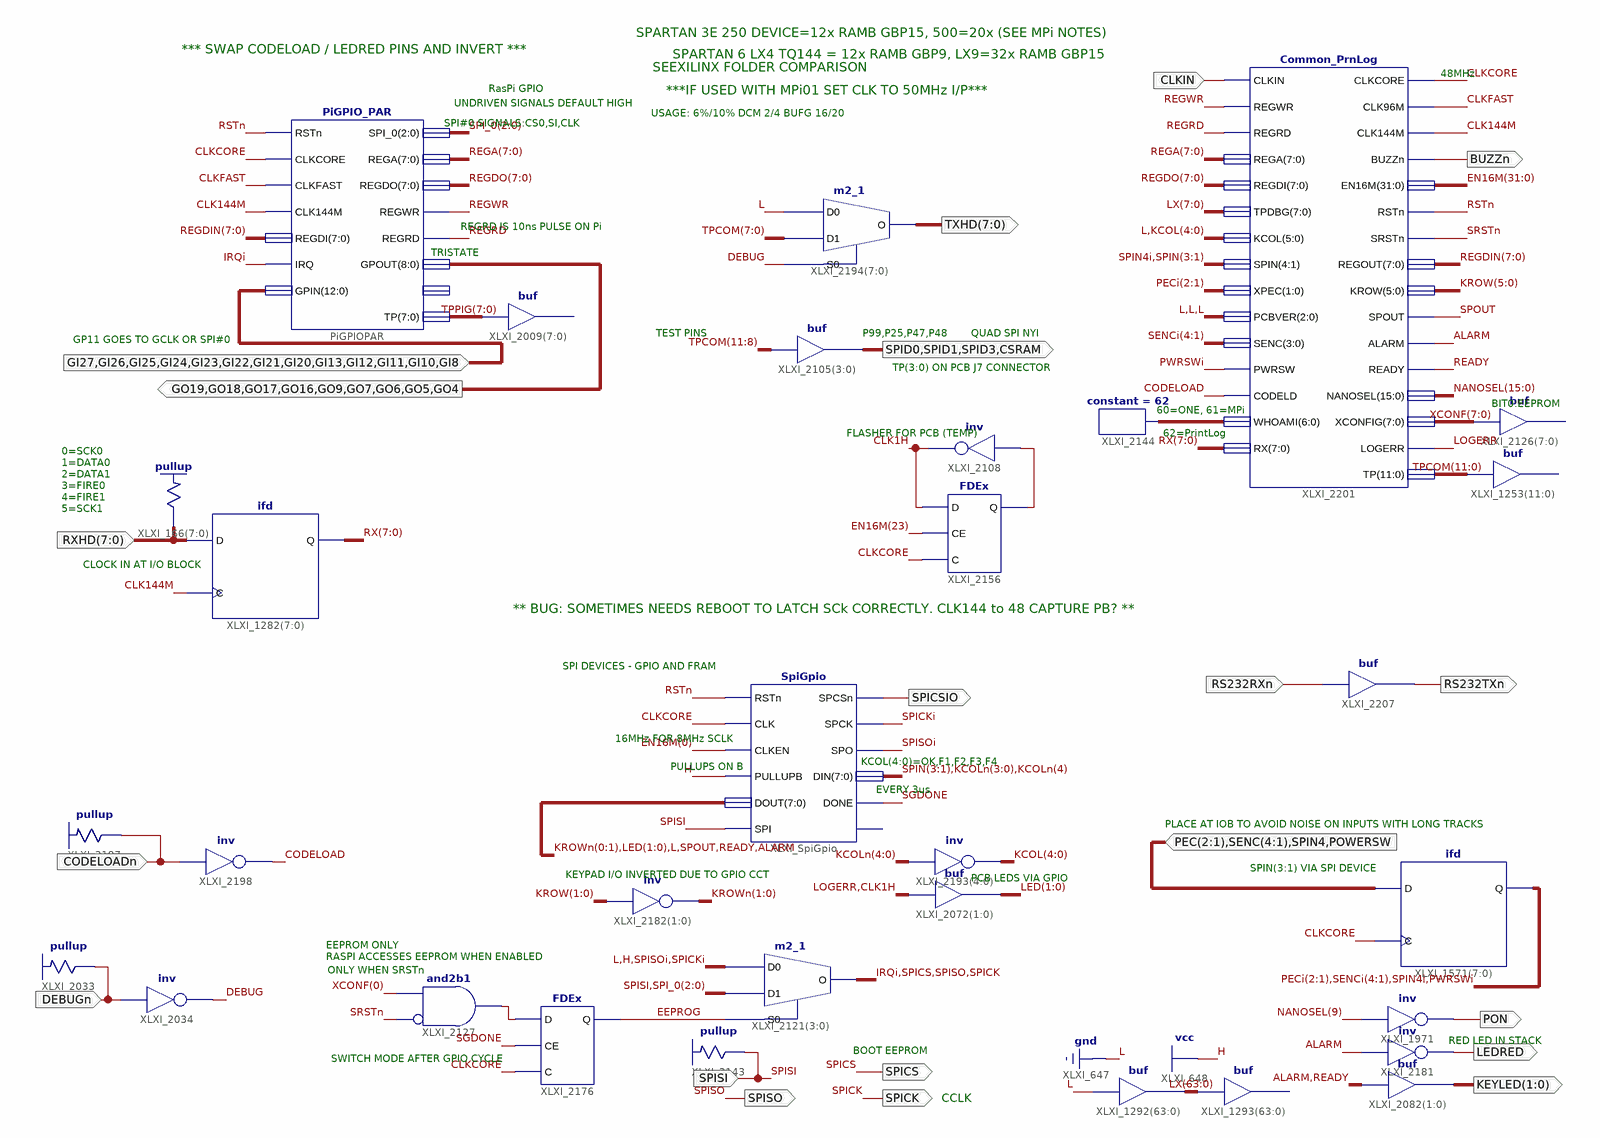
[diagram p0: schematic sheet 1]
// Xilinx ISE schematic PrintLog_MPi02.sch (spartan6) as structural Verilog: 31 symbols, 20 ports
module PrintLog_MPi02 (
  input  DEBUGn,
  input  [7:0] RXHD,
  input  SPISI,
  input  [2:1] PEC,
  input  [4:1] SENC,
  input  SPIN4,
  input  POWERSW,
  input  GI27,
  input  GI26,
  input  GI25,
  input  GI24,
  input  GI23,
  input  GI22,
  input  GI21,
  input  GI20,
  input  GI13,
  input  GI12,
  input  GI11,
  input  GI10,
  input  GI8,
  input  CLKIN,
  input  RS232RXn,
  input  CODELOADn,
  output [1:0] KEYLED,
  output LEDRED,
  output PON,
  output SPICK,
  output SPICS,
  output SPISO,
  output SPICSIO,
  output BUZZn,
  output GO19,
  output GO18,
  output GO17,
  output GO16,
  output GO9,
  output GO7,
  output GO6,
  output GO5,
  output GO4,
  output RS232TXn,
  output SPID0,
  output SPID1,
  output SPID3,
  output CSRAM,
  output [7:0] TXHD
);

  wire ALARM, CLK1H, CLK144M, CLKCORE, CLKFAST, CODELOAD, DEBUG, EEPROG, IRQi, L, LOGERR, PWRSWi, READY,
       REGRD, REGWR, RSTn, SGDONE, SPICKi, SPIN4i, SPISOi, SPOUT, SRSTn, XLXN_184, XLXN_379;
  wire [1:0] KROWn, LED;
  wire [2:0] SPI_0;
  wire [2:1] PECi;
  wire [3:1] SPIN;
  wire [4:0] KCOL, KCOLn;
  wire [4:1] SENCi;
  wire [5:0] KROW;
  wire [6:0] XLXN_196;
  wire [7:0] REGA, REGDIN, REGDO, RX, TPPIG, XCONF;
  wire [11:0] TPCOM;
  wire [15:0] NANOSEL;
  wire [31:0] EN16M;
  wire [63:0] LX;

  \pullup  XLXI_2033 (.O(DEBUGn));
  not XLXI_2034 (DEBUG, DEBUGn);
  \pullup  XLXI_166[7:0] (.O(RXHD));
  assign LX = {64{L}};  // buf XLXI_1292[63..0], 64 bits wide
  // buf XLXI_1293[63..0] has open pins: I=LX, O=open
  assign KEYLED = {ALARM, READY};  // buf XLXI_2082[1..0], 2 bits wide
  not XLXI_1971 (PON, NANOSEL[9]);
  \pullup  XLXI_2143 (.O(SPISI));
  ifd XLXI_1571[7:0] (.C(CLKCORE), .D({PEC, SENC, SPIN4, POWERSW}), .Q({PECi, SENCi, SPIN4i, PWRSWi}));
  FDEx XLXI_2176 (.C(CLKCORE), .CE(SGDONE), .D(XLXN_379), .Q(EEPROG));
  and XLXI_2127 (XLXN_379, ~SRSTn, XCONF[0]);  // and2b1
  SpiGpio XLXI_SpiGpio (
    .CLK(CLKCORE), .CLKEN(EN16M[0]), .PULLUPB(1'b1), .DIN({SPIN, KCOLn[3:0], KCOLn[4]}), .DONE(SGDONE),
    .DOUT({KROWn[0], KROWn[1], LED, L, SPOUT, READY, ALARM}), .RSTn(RSTn), .SPCK(SPICKi), .SPCSn(SPICSIO),
    .SPI(SPISI), .SPO(SPISOi));  // open: CYCLE
  assign LED = {LOGERR, CLK1H};  // buf XLXI_2072[1..0], 2 bits wide
  assign KCOL = ~KCOLn;  // inv XLXI_2193[4..0], 5 bits wide
  // buf XLXI_2009[7..0] has open pins: I=TPPIG, O=open
  m2_1 XLXI_2121[3:0] (
    .D0({L, 1'b1, SPISOi, SPICKi}), .D1({SPISI, SPI_0}), .S0(EEPROG), .O({IRQi, SPICS, SPISO, SPICK}));
  // buf XLXI_1253[11..0] has open pins: I=TPCOM, O=open
  // buf XLXI_2126[7..0] has open pins: I=XCONF, O=open
  Common_PrnLog XLXI_2201 (
    .ALARM(ALARM), .BUZZn(BUZZn), .CLK144M(CLK144M), .CLK96M(CLKFAST), .CLKCORE(CLKCORE), .CLKIN(CLKIN),
    .CODELD(CODELOAD), .EN16M(EN16M), .KCOL({L, KCOL}), .KROW(KROW), .LOGERR(LOGERR), .NANOSEL(NANOSEL),
    .PCBVER({3{L}}), .PWRSW(PWRSWi), .READY(READY), .REGA(REGA), .REGDI(REGDO), .REGOUT(REGDIN),
    .REGRD(REGRD), .REGWR(REGWR), .RSTn(RSTn), .RX(RX), .SENC(SENCi), .SPIN({SPIN4i, SPIN}), .SPOUT(SPOUT),
    .SRSTn(SRSTn), .TP(TPCOM), .TPDBG(LX[7:0]), .WHOAMI(XLXN_196), .XCONFIG(XCONF), .XPEC(PECi));
  constant #(.CValue("62")) XLXI_2144 (.O(XLXN_196));
  assign KROWn = ~KROW[1:0];  // inv XLXI_2182[1..0], 2 bits wide
  buf XLXI_2207 (RS232TXn, RS232RXn);
  not XLXI_2181 (LEDRED, ALARM);
  assign {SPID0, SPID1, SPID3, CSRAM} = TPCOM[11:8];  // buf XLXI_2105[3..0], 4 bits wide
  m2_1 XLXI_2194[7:0] (.D0(L), .D1(TPCOM[7:0]), .S0(DEBUG), .O(TXHD));
  ifd XLXI_1282[7:0] (.C(CLK144M), .D(RXHD), .Q(RX));
  PiGPIO_PAR PiGPIOPAR (
    .CLK144M(CLK144M), .CLKCORE(CLKCORE), .CLKFAST(CLKFAST),
    .GPIN({GI27, GI26, GI25, GI24, GI23, GI22, GI21, GI20, GI13, GI12, GI11, GI10, GI8}),
    .GPOUT({GO19, GO18, GO17, GO16, GO9, GO7, GO6, GO5, GO4}), .IRQ(IRQi), .REGA(REGA), .REGDI(REGDIN),
    .REGDO(REGDO), .REGRD(REGRD), .REGWR(REGWR), .RSTn(RSTn), .SPI_0(SPI_0), .TP(TPPIG));  // open: LASTWR
  \pullup  XLXI_2197 (.O(CODELOADn));
  not XLXI_2198 (CODELOAD, CODELOADn);
  not XLXI_2108 (CLK1H, XLXN_184);
  FDEx XLXI_2156 (.C(CLKCORE), .CE(EN16M[23]), .D(CLK1H), .Q(XLXN_184));
  // also tied to GND on the sheet: L

  // Notes on the sheet:
  //   SPARTAN 3E 250 DEVICE=12x RAMB GBP15, 500=20x (SEE MPi NOTES)
  //   *** SWAP CODELOAD / LEDRED PINS AND INVERT ***
  //   SPARTAN 6 LX4 TQ144 = 12x RAMB GBP9, LX9=32x RAMB GBP15
  //   SEEXILINX FOLDER COMPARISON
  //   48MHz
  //   RasPi GPIO
  //   ***IF USED WITH MPi01 SET CLK TO 50MHz I/P***
  //   UNDRIVEN SIGNALS DEFAULT HIGH
  //   USAGE: 6%/10% DCM 2/4 BUFG 16/20
  //   SPI#0 SIGNALS:CS0,SI,CLK
  //   REGRD IS 10ns PULSE ON Pi
  //   TRISTATE
  //   TEST PINS
  //   P99,P25,P47,P48
  //   QUAD SPI NYI
  //   GP11 GOES TO GCLK OR SPI#0
  //   TP(3:0) ON PCB J7 CONNECTOR
  //   BIT0:EEPROM
  //   60=ONE, 61=MPi
  //   FLASHER FOR PCB (TEMP)
  //   62=PrintLog
  //   0=SCK0
  //   1=DATA0
  //   2=DATA1
  //   3=FIRE0
  //   4=FIRE1
  //   5=SCK1
  //   CLOCK IN AT I/O BLOCK
  //   ** BUG: SOMETIMES NEEDS REBOOT TO LATCH SCk CORRECTLY. CLK144 to 48 CAPTURE PB? **
  //   SPI DEVICES - GPIO AND FRAM
  //   16MHz FOR 8MHz SCLK
  //   KCOL(4:0)=OK,F1,F2,F3,F4
  //   PULLUPS ON B
  //   EVERY 3us
  //   PLACE AT IOB TO AVOID NOISE ON INPUTS WITH LONG TRACKS
  //   SPIN(3:1) VIA SPI DEVICE
  //   KEYPAD I/O INVERTED DUE TO GPIO CCT
  //   PCB LEDS VIA GPIO
  //   EEPROM ONLY
  //   RASPI ACCESSES EEPROM WHEN ENABLED
  //   ONLY WHEN SRSTn
  //   RED LED IN STACK
  //   BOOT EEPROM
  //   SWITCH MODE AFTER GPIO CYCLE
  //   CCLK
endmodule
